# Altium schematic sheet KS-WL-GW-INTERFACE.SchDoc
size A3; CheckedBy: Fanmingjie; Author: Jason Huang; DrawnBy: Chen Minjie; Address1: Buliding 5, No.1528,; Address2: Gu Mei Rd HQ6,; Address3: Shanghai, China; Address4: 200233; Revision: 0.1; SheetNumber: 1; SheetTotal: 1; DocumentName: NGHA SCC V0.1; ProjectName: NGHA
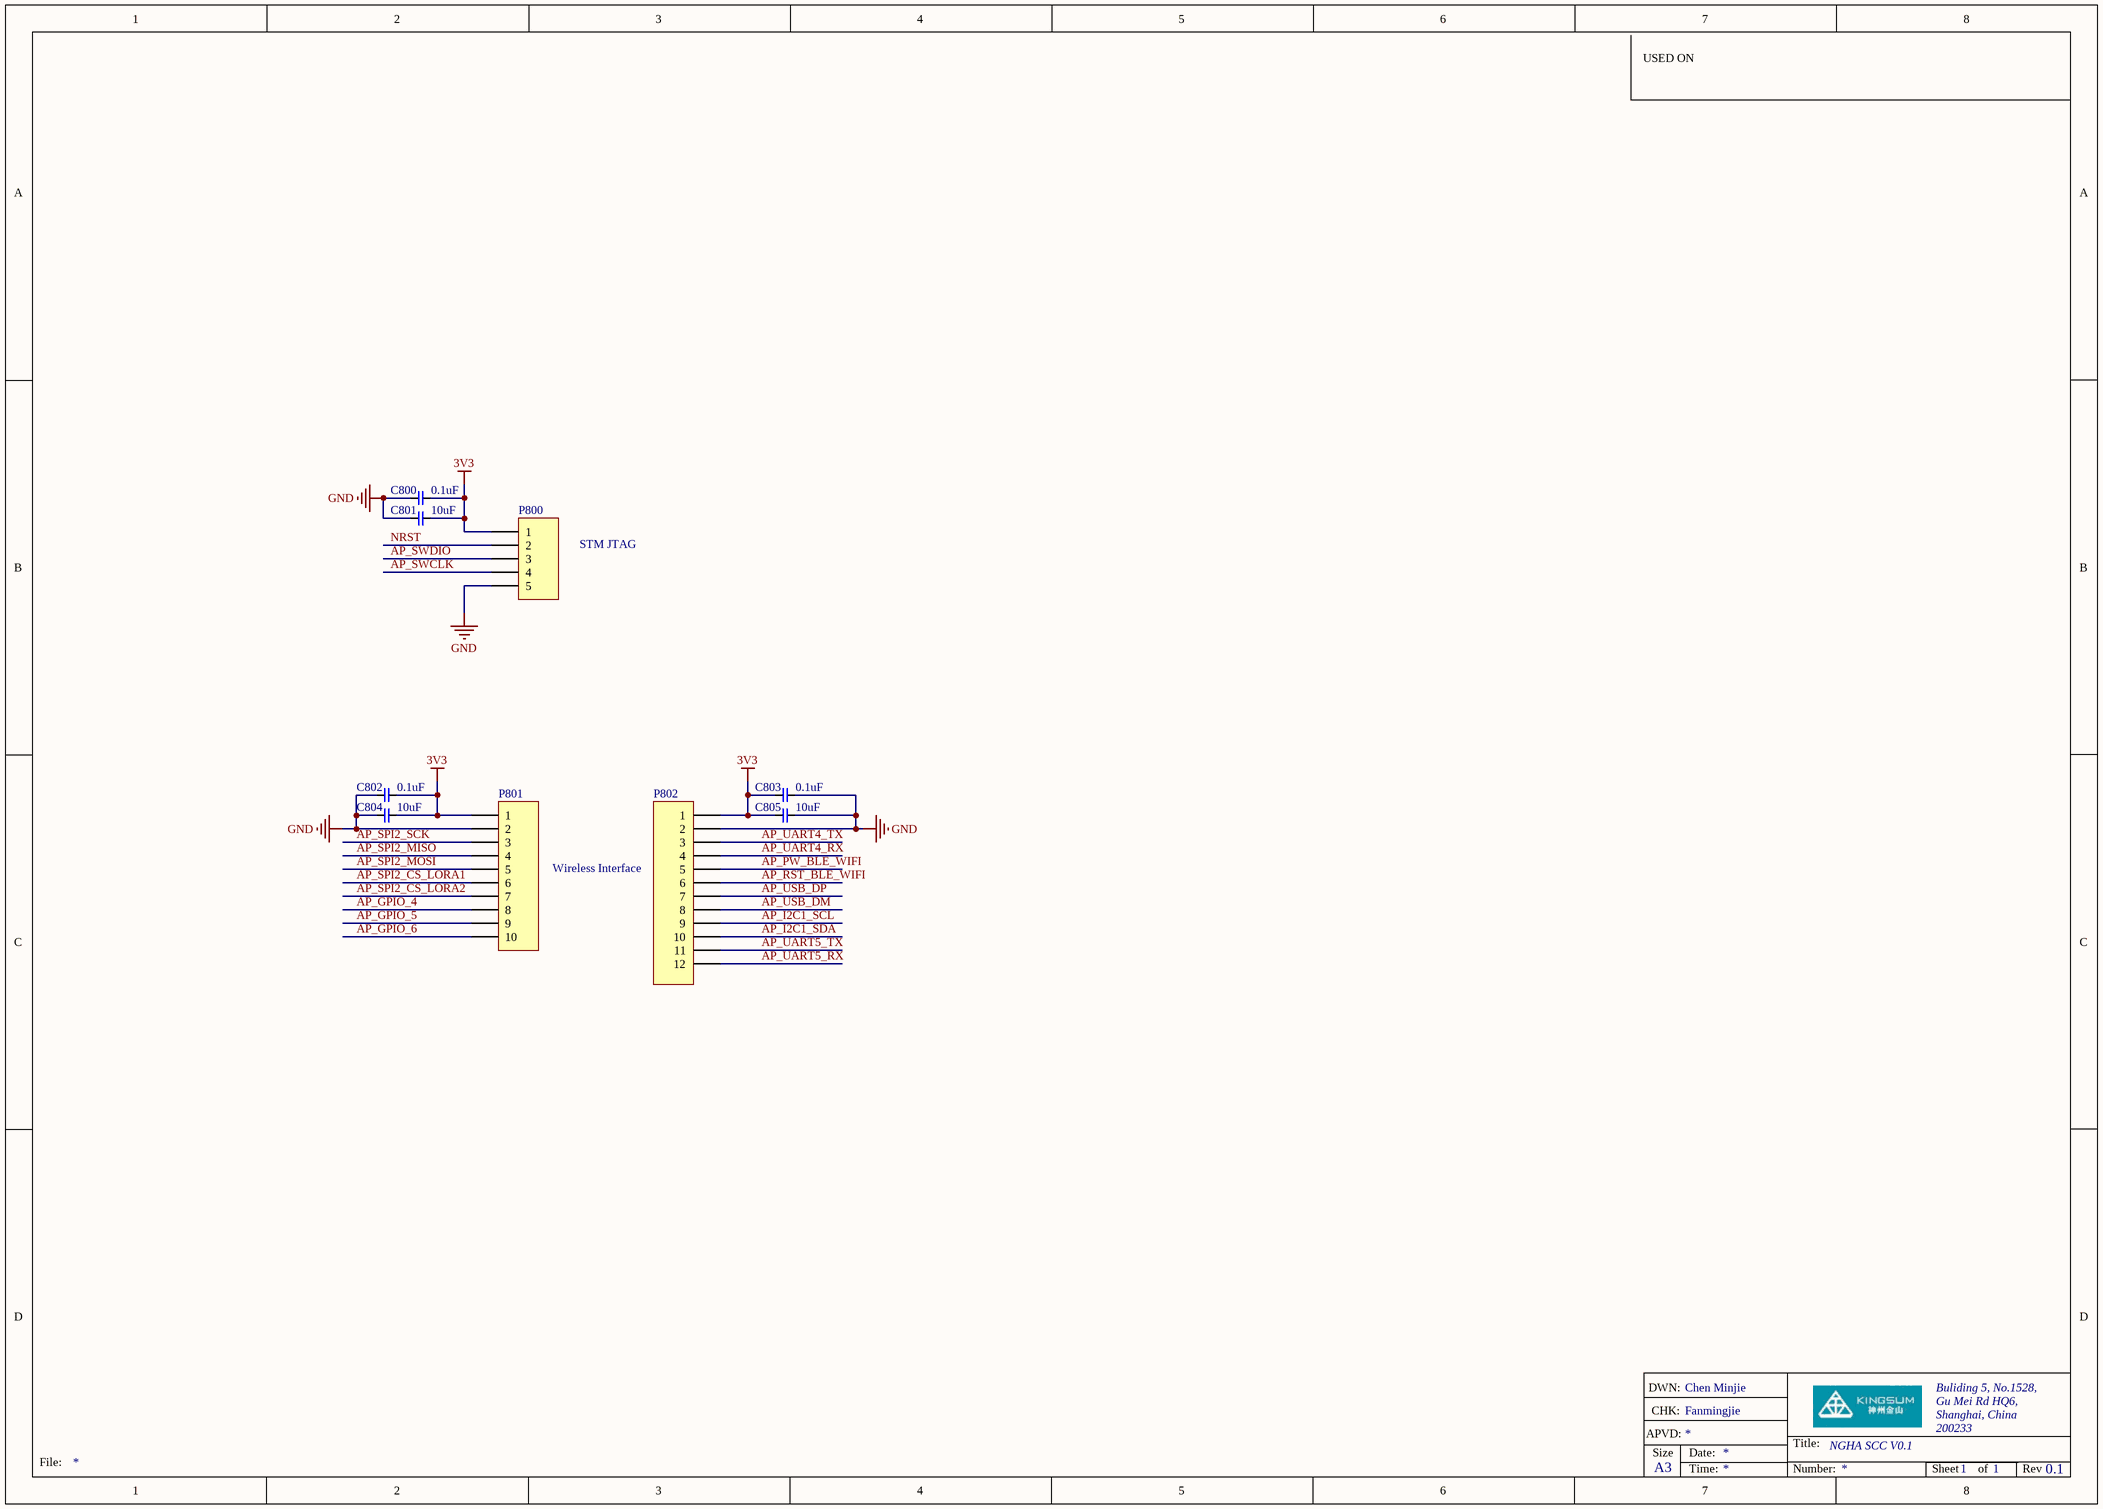
[diagram p0: KS-WL-GW-INTERFACE.SchDoc]

## Parts
C800  0.1uF  [0402 CAP]
C801  10uF  [C1206_L]
C802  0.1uF  [0402 CAP]
C803  0.1uF  [0402 CAP]
C804  10uF  [C1206_L]
C805  10uF  [C1206_L]
P800  ADE-CONN-Header 5  [HDR1X5]  (value not drawn)
P801  ADE-CONN-Header 10  [HDR1X10]  (value not drawn)
P802  ADE-CONN-Header 12  [HDR1X12]  (value not drawn)

## Nets
3V3: C800.1 C801.1 C802.1 C803.2 C804.1 C805.2 P800.1 P801.1 P802.1
GND: C800.2 C801.2 C802.2 C803.1 C804.2 C805.1 P800.5 P801.2 P802.2
AP_GPIO_4: P801.8
AP_GPIO_5: P801.9
AP_GPIO_6: P801.10
AP_I2C1_SCL: P802.9
AP_I2C1_SDA: P802.10
AP_PW_BLE_WIFI: P802.5
AP_RST_BLE_WIFI: P802.6
AP_SPI2_CS_LORA1: P801.6
AP_SPI2_CS_LORA2: P801.7
AP_SPI2_MISO: P801.4
AP_SPI2_MOSI: P801.5
AP_SPI2_SCK: P801.3
AP_SWCLK: P800.4
AP_SWDIO: P800.3
AP_UART4_RX: P802.4
AP_UART4_TX: P802.3
AP_UART5_RX: P802.12
AP_UART5_TX: P802.11
AP_USB_DM: P802.8
AP_USB_DP: P802.7
NRST: P800.2

## Notes on the sheet
- USED ON
- STM JTAG
- (near P802) Wireless Interface
- DWN:
- APVD:
- CHK:
- Size
- Date:
- Title:
- File:
- A3
- Time:
- Number:
- Sheet
- of
- Rev

## Library data of the parts
C800 C802 C803 = ADE-C0402-0.1U: Non-polarised capacitor; Part Rev: V; Part Description: CAPACITOR, CERAMIC CHIP, 0402 CASE, SURFACE MOUNT , 0.1 uF +/-20% 25 V, X7R; Manufacturer: MURATA; Tolerance: +/-10%; Volt-Rated: 25 V; Signal Integrity: Cap; Designator: GRM155R61E104KA87; Option: 0; TE PN: ADE-C0402-0.1U; Series: MLCC; RoHS Compliant: YES; Value: 0.1uF; Package: 0402; Footprint: 0402; SPICE model: CAP; Published: 10/14/2016; Publisher: TE Connectivity; LatestRevisionDate: 04/22/2013; LatestRevisionNote: Production; ComponentLink1Description: Datasheet; ComponentLink1URL: http://engineeringportal.tycoelectronics.com/web/engineering/part-inquiry?PartNo=1-20065-7; Mfr_PN: GRM155R61E104KA87; ComponentLink3Description: Package; ComponentLink3URL: http://www.murata.com/products/catalog/pdf/c02e.pdf; ComponentLink2Description: Web Page; ComponentLink2URL: http://dmtec.tycoelectronics.com/dmtec/servlet/DocumentLookup?type=Production+Drawing&name=20065&format=PDF; Manufacturer2: Yageo; Mfr_PN2: CC0402KRX7R8BB104
C801 C804 C805 = ADE-C1206-10U: Non-polarised capacitor; Part Rev: V; Part Description: CAPACITOR, CERAMIC CHIP, 1206 CASE, SURFACE MOUNT , 10uF +/-20% 25V, X5R; Manufacturer: MURATA; Tolerance: +/-20%; Volt-Rated: 25V; Signal Integrity: Cap; Designator: GRM31CR61E106KE15; Option: 0; TE PN: ADE-C1206-10U; Series: MLCC; RoHS Compliant: YES; Value: 10uF; Package: C1206_L; Footprint: C1206; SPICE model: CAP; Published: 10/17/2016; Publisher: TE Connectivity; LatestRevisionDate: 08/05/2013; LatestRevisionNote: Production; ComponentLink1Description: Datasheet; ComponentLink1URL: http://www.murata.com/products/catalog/pdf/c02e.pdf; Mfr_PN: GRM31CR61E106KE15; ComponentLink3Description: Package; ComponentLink2Description: Web Page
P800 = ADE-CONN-Header 5: Header, 5-Pin; Manufacturer: TE; Mfr_PN: 1-829487-0; Part Description: Header 2.54mm 5P; Option: 0; LatestRevisionDate: 17-Jul-2002; LatestRevisionNote: Re-released for DXP Platform.; Publisher: TE Connectivity; ComponentLink2Description: Web Page; ComponentLink1Description: Datasheet; ComponentLink3Description: Package; Published: 10/20/2016; TE PN: ADE-CONN-Header 5
P801 = ADE-CONN-Header 10: Header, 10-Pin; Manufacturer: TE; Mfr_PN: 1-829487-0; Part Description: Header 2.54mm 10P; Option: 0; LatestRevisionDate: 17-Jul-2002; LatestRevisionNote: Re-released for DXP Platform.; Publisher: TE Connectivity; ComponentLink2Description: Web Page; ComponentLink1Description: Datasheet; ComponentLink3Description: Package; Published: 10/20/2016; TE PN: ADE-CONN-Header 10
P802 = ADE-CONN-Header 12: Header, 12-Pin; Manufacturer: TE; Mfr_PN: 1-829487-0; Part Description: Header 2.54mm 12P; Option: 0; LatestRevisionDate: 17-Jul-2002; LatestRevisionNote: Re-released for DXP Platform.; Publisher: TE Connectivity; ComponentLink2Description: Web Page; ComponentLink1Description: Datasheet; ComponentLink3Description: Package; Published: 10/20/2016; TE PN: ADE-CONN-Header 12